# Altium schematic sheet power_regulator_pmic.SchDoc
size A3; SheetNumber: 4; SheetTotal: 21
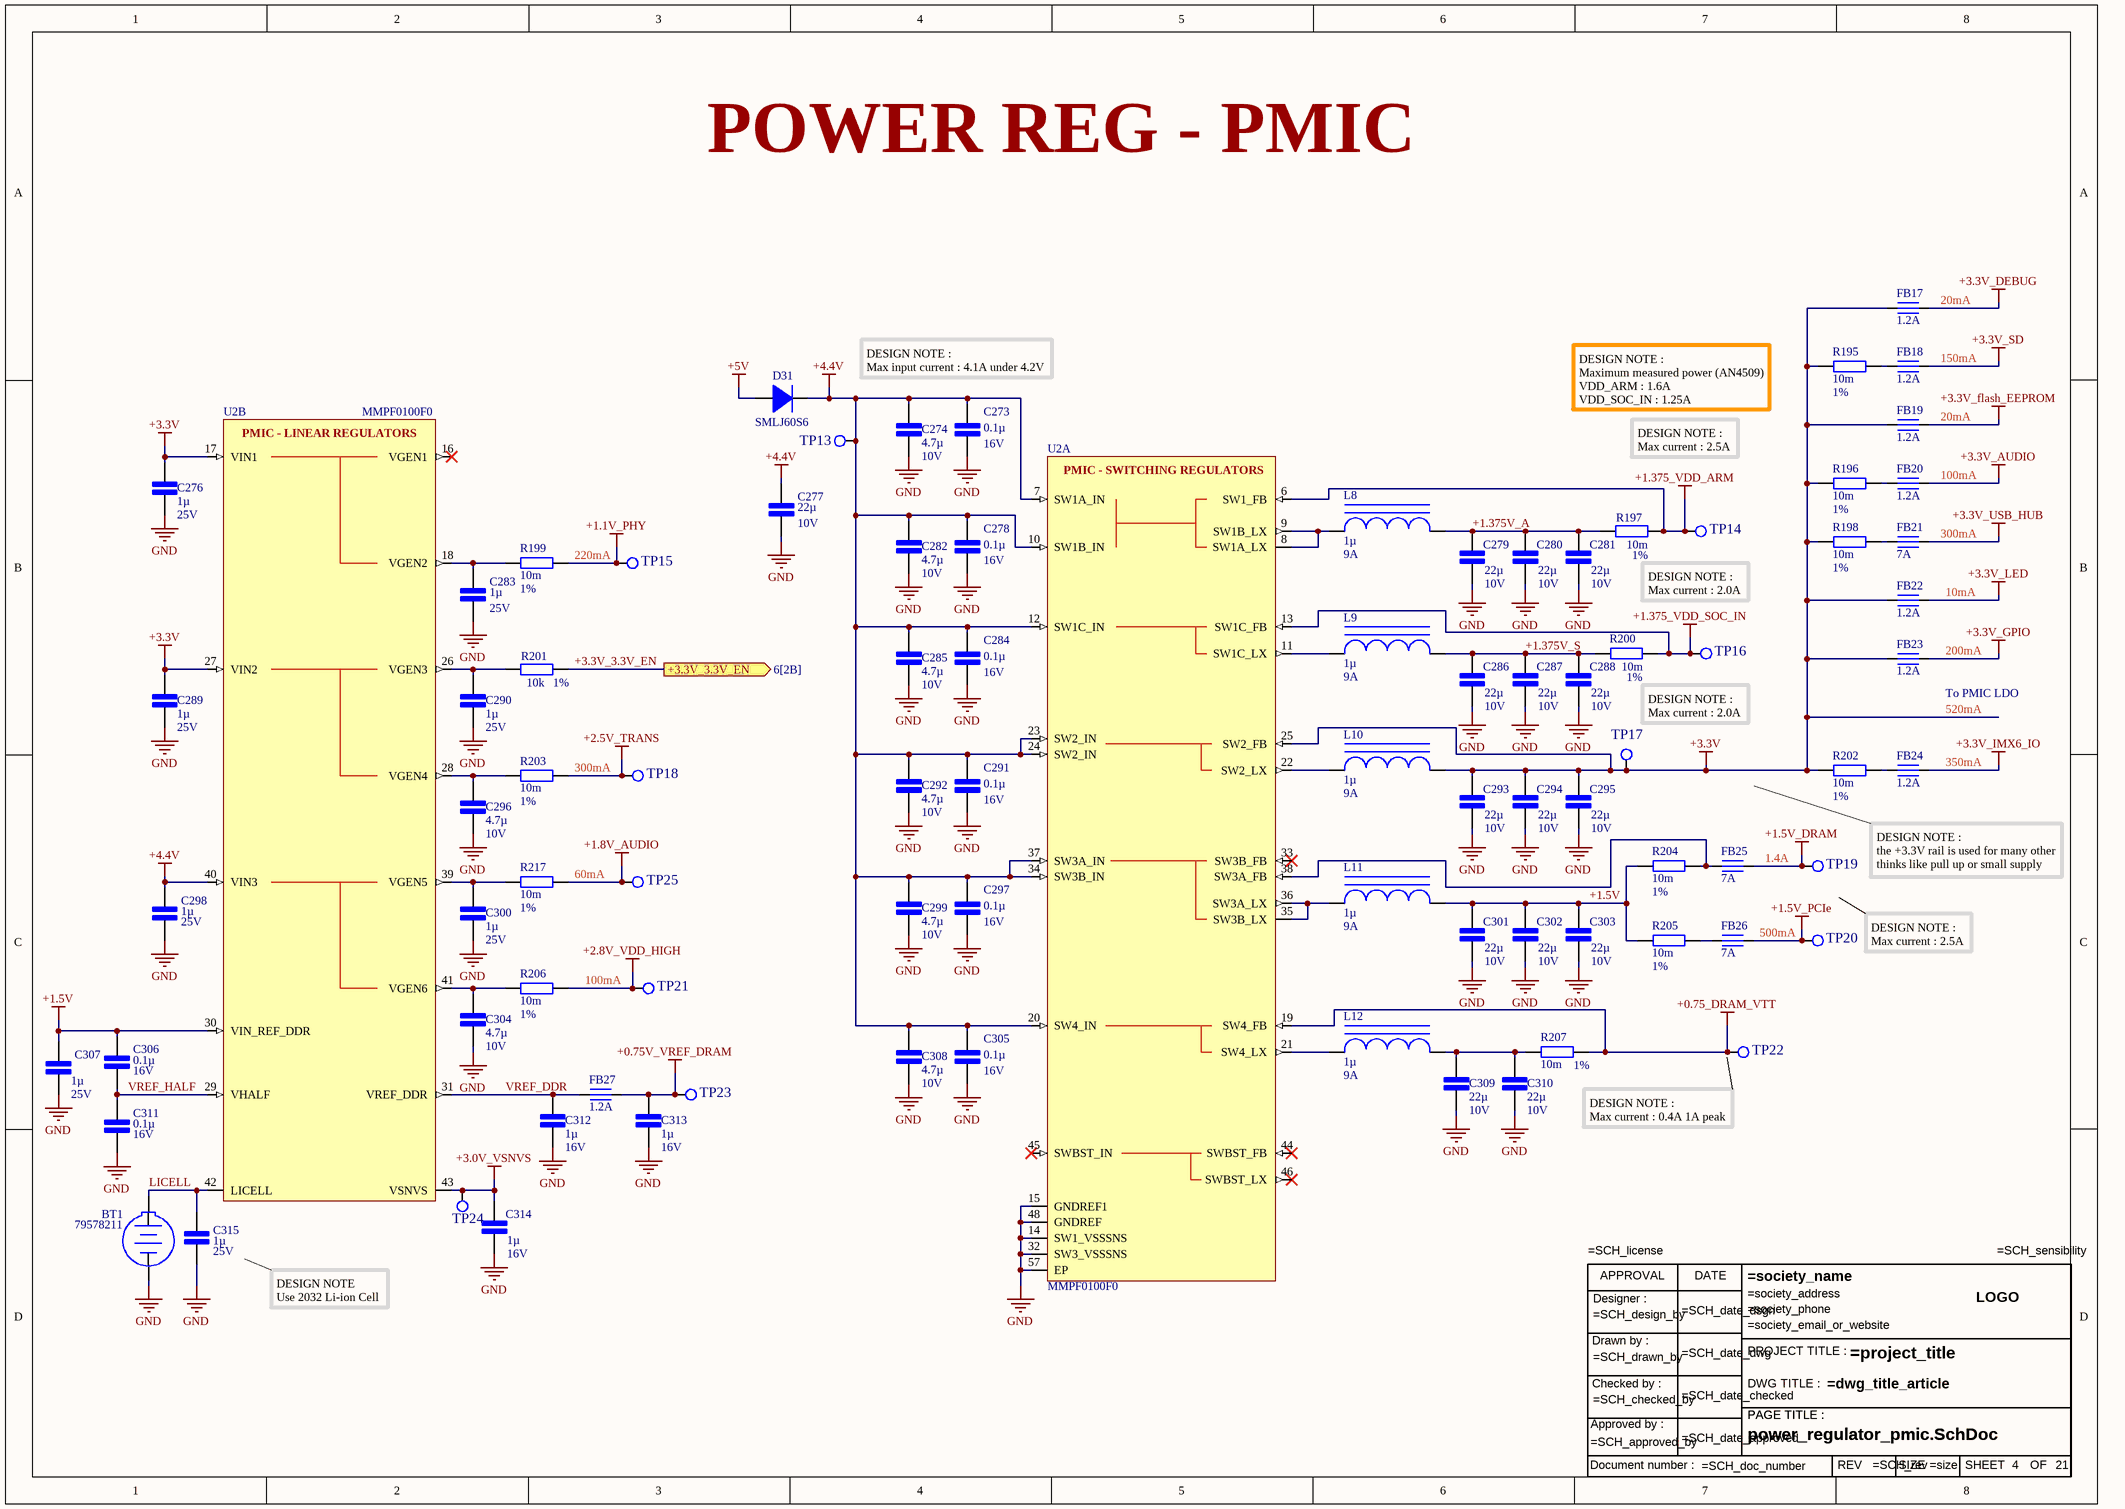
[diagram p0: power_regulator_pmic.SchDoc]

## Parts
BT1  79578211  [Battery holder]
C273  0.1µ  Tension du diélectrique: 16V  [Cap cer 0402/1005]
C274  4.7µ  Tension du diélectrique: 10V  [Cap cer 0402/1005]
C276  1µ  Tension du diélectrique: 25V  [Cap cer 0402/1005]
C277  22µ  Tension du diélectrique: 10V  [Cap cer 0603/4608]
C278  0.1µ  Tension du diélectrique: 16V  [Cap cer 0402/1005]
C279  22µ  Tension du diélectrique: 10V  [Cap cer 0603/4608]
C280  22µ  Tension du diélectrique: 10V  [Cap cer 0603/4608]
C281  22µ  Tension du diélectrique: 10V  [Cap cer 0603/4608]
C282  4.7µ  Tension du diélectrique: 10V  [Cap cer 0402/1005]
C283  1µ  Tension du diélectrique: 25V  [Cap cer 0402/1005]
C284  0.1µ  Tension du diélectrique: 16V  [Cap cer 0402/1005]
C285  4.7µ  Tension du diélectrique: 10V  [Cap cer 0402/1005]
C286  22µ  Tension du diélectrique: 10V  [Cap cer 0603/4608]
C287  22µ  Tension du diélectrique: 10V  [Cap cer 0603/4608]
C288  22µ  Tension du diélectrique: 10V  [Cap cer 0603/4608]
C289  1µ  Tension du diélectrique: 25V  [Cap cer 0402/1005]
C290  1µ  Tension du diélectrique: 25V  [Cap cer 0402/1005]
C291  0.1µ  Tension du diélectrique: 16V  [Cap cer 0402/1005]
C292  4.7µ  Tension du diélectrique: 10V  [Cap cer 0402/1005]
C293  22µ  Tension du diélectrique: 10V  [Cap cer 0603/4608]
C294  22µ  Tension du diélectrique: 10V  [Cap cer 0603/4608]
C295  22µ  Tension du diélectrique: 10V  [Cap cer 0603/4608]
C296  4.7µ  Tension du diélectrique: 10V  [Cap cer 0402/1005]
C297  0.1µ  Tension du diélectrique: 16V  [Cap cer 0402/1005]
C298  1µ  Tension du diélectrique: 25V  [Cap cer 0402/1005]
C299  4.7µ  Tension du diélectrique: 10V  [Cap cer 0402/1005]
C300  1µ  Tension du diélectrique: 25V  [Cap cer 0402/1005]
C301  22µ  Tension du diélectrique: 10V  [Cap cer 0603/4608]
C302  22µ  Tension du diélectrique: 10V  [Cap cer 0603/4608]
C303  22µ  Tension du diélectrique: 10V  [Cap cer 0603/4608]
C304  4.7µ  Tension du diélectrique: 10V  [Cap cer 0402/1005]
C305  0.1µ  Tension du diélectrique: 16V  [Cap cer 0402/1005]
C306  0.1µ  Tension du diélectrique: 16V  [Cap cer 0402/1005]
C307  1µ  Tension du diélectrique: 25V  [Cap cer 0402/1005]
C308  4.7µ  Tension du diélectrique: 10V  [Cap cer 0402/1005]
C309  22µ  Tension du diélectrique: 10V  [Cap cer 0603/4608]
C310  22µ  Tension du diélectrique: 10V  [Cap cer 0603/4608]
C311  0.1µ  Tension du diélectrique: 16V  [Cap cer 0402/1005]
C312  1µ  Tension du diélectrique: 16V  [Cap cer 0402/1005]
C313  1µ  Tension du diélectrique: 16V  [Cap cer 0402/1005]
C314  1µ  Tension du diélectrique: 16V  [Cap cer 0402/1005]
C315  1µ  Tension du diélectrique: 25V  [Cap cer 0402/1005]
D31  SMLJ60S6  [DO-214AB]
FB17  1.2A  [inductor 0402/1005]
FB18  1.2A  [inductor 0402/1005]
FB19  1.2A  [inductor 0402/1005]
FB20  1.2A  [inductor 0402/1005]
FB21  7A  [inductor 0603/1603]
FB22  1.2A  [inductor 0402/1005]
FB23  1.2A  [inductor 0402/1005]
FB24  1.2A  [inductor 0402/1005]
FB25  7A  [inductor 0603/1603]
FB26  7A  [inductor 0603/1603]
FB27  1.2A  [inductor 0402/1005]
L8  1µ  Saturation: 9A  [inductor 4020 MAPI]
L9  1µ  Saturation: 9A  [inductor 4020 MAPI]
L10  1µ  Saturation: 9A  [inductor 4020 MAPI]
L11  1µ  Saturation: 9A  [inductor 4020 MAPI]
L12  1µ  Saturation: 9A  [inductor 4020 MAPI]
R195  10m  pourcentage: 1%  [Res 0603/1603]
R196  10m  pourcentage: 1%  [Res 0603/1603]
R197  10m  pourcentage: 1%  [Res 0603/1603]
R198  10m  pourcentage: 1%  [Res 0603/1603]
R199  10m  pourcentage: 1%  [Res 0603/1603]
R200  10m  pourcentage: 1%  [Res 0603/1603]
R201  10k  pourcentage: 1%  [Res 0402/1005]
R202  10m  pourcentage: 1%  [Res 0603/1603]
R203  10m  pourcentage: 1%  [Res 0603/1603]
R204  10m  pourcentage: 1%  [Res 0603/1603]
R205  10m  pourcentage: 1%  [Res 0603/1603]
R206  10m  pourcentage: 1%  [Res 0603/1603]
R207  10m  pourcentage: 1%  [Res 0603/1603]
R217  10m  pourcentage: 1%  [Res 0603/1603]
TB21  Title bloc ANSI modified  (value not drawn)
TP13  Test Point  [testpoint 1mm]  (value not drawn)
TP14  Test Point  [testpoint 1mm]  (value not drawn)
TP15  Test Point  [testpoint 1mm]  (value not drawn)
TP16  Test Point  [testpoint 1mm]  (value not drawn)
TP17  Test Point  [testpoint 1mm]  (value not drawn)
TP18  Test Point  [testpoint 1mm]  (value not drawn)
TP19  Test Point  [testpoint 1mm]  (value not drawn)
TP20  Test Point  [testpoint 1mm]  (value not drawn)
TP21  Test Point  [testpoint 1mm]  (value not drawn)
TP22  Test Point  [testpoint 1mm]  (value not drawn)
TP23  Test Point  [testpoint 1mm]  (value not drawn)
TP24  Test Point  [testpoint 1mm]  (value not drawn)
TP25  Test Point  [testpoint 1mm]  (value not drawn)
U2  MMPF0100F0  [MMPF0100]  (parts A,B of 3)

## Ports
+3.3V_3.3V_EN (out, see 6[2B])

## Nets
+0.75_DRAM_VTT: R207.2 TP22.1(tp) U2.19(SW4_FB)
+0.75V_VREF_DRAM: C313.1 FB27.2 TP23.1(tp)
+1.1V_PHY: R199.2 TP15.1(tp)
+1.5V: C301.1 C302.1 C303.1 C306.1 C307.1 L11.2 R204.1 R205.1 U2.30(VIN_REF_DDR)
+1.5V_DRAM: FB25.2 TP19.1(tp)
+1.5V_PCIe: FB26.2 TP20.1(tp)
+1.8V_AUDIO: R217.2 TP25.1(tp)
+1.375_VDD_ARM: R197.2 TP14.1(tp) U2.6(SW1_FB)
+1.375_VDD_SOC_IN: R200.2 TP16.1(tp) U2.13(SW1C_FB)
+2.5V_TRANS: R203.2 TP18.1(tp)
+2.8V_VDD_HIGH: R206.2 TP21.1(tp)
+3.0V_VSNVS: C314.1 TP24.1(tp) U2.43(VSNVS)
+3.3V: C276.1 C289.1 C293.1 C294.1 C295.1 FB17.1 FB19.1 FB22.1 FB23.1 L10.2 R195.2 R196.1 R198.2 R202.1 TP17.1(tp) U2.17(VIN1) U2.25(SW2_FB) U2.27(VIN2)
+3.3V_AUDIO: FB20.2
+3.3V_DEBUG: FB17.2
+3.3V_flash_EEPROM: FB19.2
+3.3V_GPIO: FB23.2
+3.3V_IMX6_IO: FB24.2
+3.3V_LED: FB22.2
+3.3V_SD: FB18.2
+3.3V_USB_HUB: FB21.2
+4.4V: C273.1 C274.1 C277.1 C278.1 C282.1 C284.1 C285.1 C291.1 C292.1 C297.1 C298.1 C299.1 C305.1 C308.1 D31.K TP13.1(tp) U2.7(SW1A_IN) U2.10(SW1B_IN) U2.12(SW1C_IN) U2.20(SW4_IN) U2.23(SW2_IN) U2.24(SW2_IN) U2.34(SW3B_IN) U2.37(SW3A_IN) U2.40(VIN3)
+5V: D31.A
GND: BT1.2(-) C273.2 C274.2 C276.2 C277.2 C278.2 C279.2 C280.2 C281.2 C282.2 C283.2 C284.2 C285.2 C286.2 C287.2 C288.2 C289.2 C290.2 C291.2 C292.2 C293.2 C294.2 C295.2 C296.2 C297.2 C298.2 C299.2 C300.2 C301.2 C302.2 C303.2 C304.2 C305.2 C307.2 C308.2 C309.2 C310.2 C311.2 C312.2 C313.2 C314.2 C315.2 U2.14(SW1_VSSSNS) U2.15(GNDREF1) U2.32(SW3_VSSSNS) U2.48(GNDREF) U2.57(EP)
+1.375V_A: C279.1 C280.1 C281.1 L8.2 R197.1
+1.375V_S: C286.1 C287.1 C288.1 L9.2 R200.1
+3.3V_3.3V_EN: R201.2 ; port +3.3V_3.3V_EN
LICELL: BT1.1(+) C315.1 U2.42(LICELL)
VREF_DDR: C312.1 FB27.1 U2.31(VREF_DDR)
VREF_HALF: C306.2 C311.1 U2.29(VHALF)
NetC283_1: C283.1 R199.1 U2.18(VGEN2)
NetC290_1: C290.1 R201.1 U2.26(VGEN3)
NetC296_1: C296.1 R203.1 U2.28(VGEN4)
NetC300_1: C300.1 R217.1 U2.39(VGEN5)
NetC304_1: C304.1 R206.1 U2.41(VGEN6)
NetC309_1: C309.1 C310.1 L12.2 R207.1
NetFB18_1: FB18.1 R195.1
NetFB20_1: FB20.1 R196.2
NetFB21_1: FB21.1 R198.1
NetFB24_1: FB24.1 R202.2
NetFB25_1: FB25.1 R204.2 U2.38(SW3A_FB)
NetFB26_1: FB26.1 R205.2
NetL8_1: L8.1 U2.8(SW1A_LX) U2.9(SW1B_LX)
NetL9_1: L9.1 U2.11(SW1C_LX)
NetL10_1: L10.1 U2.22(SW2_LX)
NetL11_1: L11.1 U2.35(SW3B_LX) U2.36(SW3A_LX)
NetL12_1: L12.1 U2.21(SW4_LX)

Not connected (* = marked no-connect by the designer): U2 16(VGEN1)* 33(SW3B_FB)* 44(SWBST_FB)* 45(SWBST_IN)* 46(SWBST_LX)*

## Notes on the sheet
- POWER REG - PMIC
- (near FB17) 20mA
- DESIGN NOTE :
  Max input current : 4.1A under 4.2V
- (near FB18) 150mA
- DESIGN NOTE :
  Maximum measured power (AN4509)
  VDD_ARM : 1.6A
  VDD_SOC_IN : 1.25A
- DESIGN NOTE :
  Max current : 2.5A
- (near FB19) 20mA
- (near FB20) 100mA
- 220mA
- (near FB21) 300mA
- DESIGN NOTE :
  Max current : 2.0A
- (near FB22) 10mA
- (near FB23) 200mA
- (near FB23) To PMIC LDO
- 520mA
- 300mA
- (near FB24) 350mA
- 60mA
- 1.4A
- DESIGN NOTE :
  the +3.3V rail is used for many other thinks like pull up or small supply
- 100mA
- 500mA
- DESIGN NOTE :
  Max current : 0.4A 1A peak
- DESIGN NOTE
  Use 2032 Li-ion Cell
- (in symbol IC MMPF0100, part A) PMIC - SWITCHING REGULATORS
- (in symbol IC MMPF0100, part B) PMIC - LINEAR REGULATORS
- (in symbol Title bloc ANSI) APPROVAL; DATE; Designer :; LOGO; Drawn by :; PROJECT TITLE :; Checked by :; DWG TITLE :; PAGE TITLE :; Approved by :; Document number :; REV; SIZE; SHEET; OF

## Library data of the parts
BT1 = battery holder: WA-BCPH Battery Holder, THT, Battery Type 2450; Manufacturer: Wurth Elektronik; Battery Type: 2450; ComponentLink1Description: Manufacturer; ComponentLink1URL: http://www.we-online.de; ComponentLink2Description: Datasheet; ComponentLink2URL: https://www.we-online.com/catalog/datasheet/79578211.pdf; Manufacturer Part Number: 79578211; Mounting Technology: THT; Operating Temperature: -40 to +105degC; Published Date: July 2021; Packaging: Bag
C273 C278 C284 C291 C297 C305 = cap 0.1µ 4V: cap cer 0.1µ 16V 10% X7R 0402; Diélectrique: X7R
C274 C282 C285 C292 C296 C299 C304 C308 = cap 4.7µ 10V: cap cer 4.7µ 10V 10% X7R 0402; Diélectrique: X7R
C276 C283 C289 C290 C298 C300 C307 C315 = cap 1µ 25V: cap cer 1µ 25V 10% X5R 0402; Diélectrique: X5R
C277 C279-C281 C286-C288 C293-C295 C301-C303 C309 C310 = cap 22µ 10V: cap cer 22µ 10V 10% X5R 0603; Diélectrique: X5R
C306 C311 = cap 0.1µ 16V: cap solid electrolyte 0.1µ 6.3V 10%; Diélectrique: X7R
C312-C314 = cap 1µ 16V: cap cer 1µ 16V 10% X7R 0402; Diélectrique: X7R
D31 = Diode 600V 6A: Diode 600V 6A DO-214AB
FB17-FB20 FB22-FB24 FB27 = Ferrite bead 0402: ferrite bead 1.2A 70mohm / 74269242111; ComponentLink1Description: New link; ComponentLink1URL: https://www.we-online.com/catalog/datasheet/74269242111.pdf
FB21 FB25 FB26 = Ferrite bead 0603: ferrite bead 17AA 2mohm / 7426926222; ComponentLink1Description: New link; ComponentLink1URL: https://www.we-online.com/catalog/datasheet/7426926222.pdf
L8-L12 = inductor 1.0µ 9A: inductor 1.0µ 9A sat 4020 74438356010
R195-R200 R202-R207 R217 = res 10m 1%: res 10m 1% 0.33W 0603
R201 = res 10k 1%: res 10k 1% 0402
TB21 = Title bloc ANSI
TP13-TP25 = Test Point: Test point 1mm diameter
U2 = IC MMPF0100: PMIC; ComponentLink1Description: New link; ComponentLink1URL: D:\Carte_IMX6\datasheet\MMPF0100.pdf